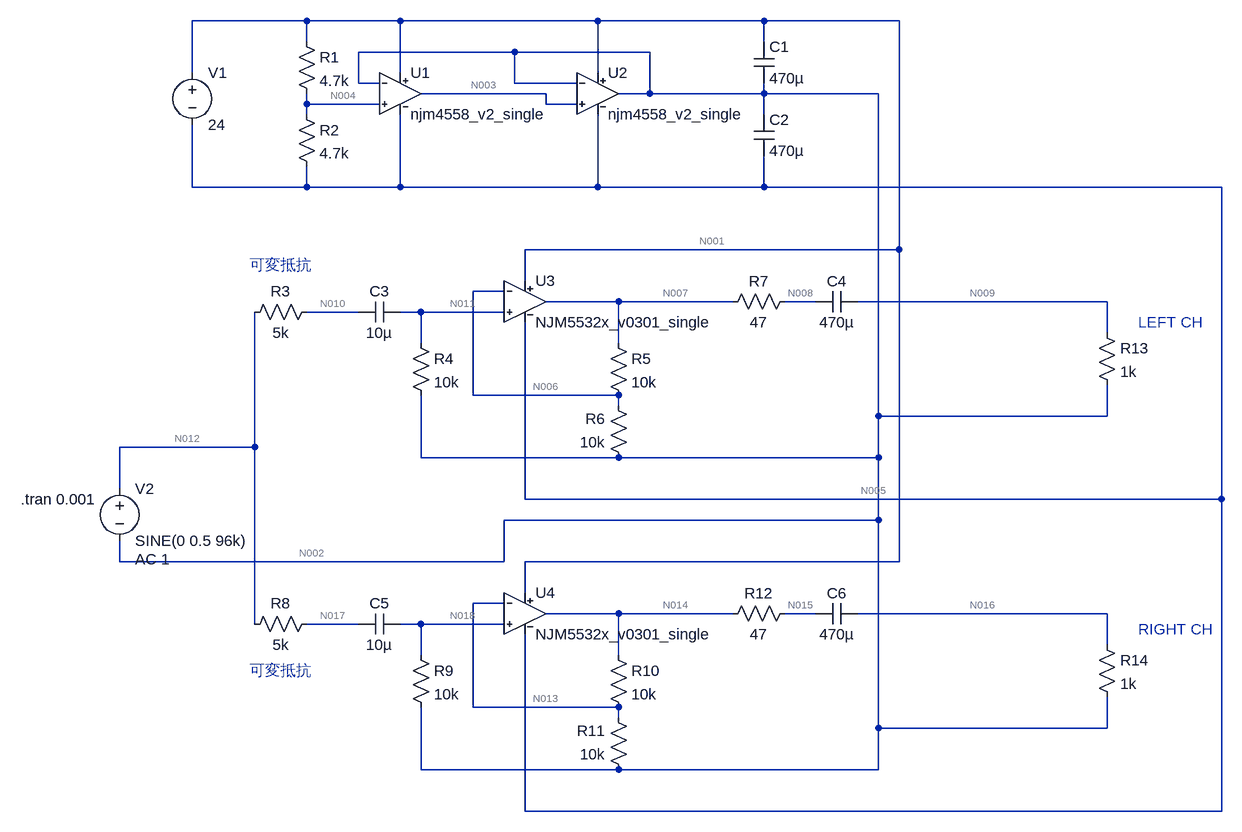
[diagram p0: schematic circuit.asc]
circuit.asc, the LTspice schematic file:
Version 4.1
SHEET 1 1748 1760
WIRE -64 48 -240 48
WIRE 80 48 -64 48
WIRE 384 48 80 48
WIRE 640 48 384 48
WIRE 848 48 640 48
WIRE -64 80 -64 48
WIRE 640 80 640 48
WIRE 256 96 16 96
WIRE 464 96 256 96
WIRE -240 128 -240 48
WIRE 80 128 80 48
WIRE 384 128 384 48
WIRE 16 144 16 96
WIRE 48 144 16 144
WIRE 256 144 256 96
WIRE 352 144 256 144
WIRE 304 160 112 160
WIRE 464 160 464 96
WIRE 464 160 416 160
WIRE 640 160 640 144
WIRE 640 160 464 160
WIRE 816 160 640 160
WIRE -64 176 -64 160
WIRE 48 176 -64 176
WIRE 304 176 304 160
WIRE 352 176 304 176
WIRE -64 192 -64 176
WIRE 640 192 640 160
WIRE -240 304 -240 208
WIRE -64 304 -64 272
WIRE -64 304 -240 304
WIRE 80 304 80 192
WIRE 80 304 -64 304
WIRE 384 304 384 192
WIRE 384 304 80 304
WIRE 640 304 640 256
WIRE 640 304 384 304
WIRE 1344 304 640 304
WIRE 848 400 848 48
WIRE 848 400 272 400
WIRE 272 448 272 400
WIRE 240 464 192 464
WIRE 416 480 304 480
WIRE 592 480 416 480
WIRE 720 480 672 480
WIRE 1168 480 784 480
WIRE 16 496 -64 496
WIRE 112 496 80 496
WIRE 240 496 112 496
WIRE 1168 528 1168 480
WIRE 112 544 112 496
WIRE 416 544 416 480
WIRE 192 624 192 464
WIRE 416 624 192 624
WIRE 416 640 416 624
WIRE 816 656 816 160
WIRE 1168 656 1168 608
WIRE 1168 656 816 656
WIRE -144 704 -144 496
WIRE -144 704 -352 704
WIRE 112 720 112 624
WIRE 416 720 112 720
WIRE 816 720 816 656
WIRE 816 720 416 720
WIRE -352 768 -352 704
WIRE 272 784 272 512
WIRE 1344 784 1344 304
WIRE 1344 784 272 784
WIRE 816 816 816 720
WIRE 816 816 240 816
WIRE -352 880 -352 848
WIRE 240 880 240 816
WIRE 240 880 -352 880
WIRE 848 880 848 400
WIRE 848 880 272 880
WIRE 272 928 272 880
WIRE 240 944 192 944
WIRE 416 960 304 960
WIRE 592 960 416 960
WIRE 720 960 672 960
WIRE 1168 960 784 960
WIRE -144 976 -144 704
WIRE 16 976 -64 976
WIRE 112 976 80 976
WIRE 240 976 112 976
WIRE 1168 1008 1168 960
WIRE 112 1024 112 976
WIRE 416 1024 416 960
WIRE 192 1104 192 944
WIRE 416 1104 192 1104
WIRE 416 1120 416 1104
WIRE 816 1136 816 816
WIRE 1168 1136 1168 1088
WIRE 1168 1136 816 1136
WIRE 112 1200 112 1104
WIRE 416 1200 112 1200
WIRE 816 1200 816 1136
WIRE 816 1200 416 1200
WIRE 272 1264 272 992
WIRE 1344 1264 1344 784
WIRE 1344 1264 272 1264
SYMBOL NJM4558 80 96 R0
SYMATTR InstName U1
SYMBOL NJM4558 384 96 R0
SYMATTR InstName U2
SYMBOL voltage -240 112 R0
WINDOW 123 0 0 Left 0
WINDOW 39 0 0 Left 0
SYMATTR InstName V1
SYMATTR Value 24
SYMBOL res -80 64 R0
SYMATTR InstName R1
SYMATTR Value 4.7k
SYMATTR SpiceLine tol=1
SYMBOL res -80 176 R0
SYMATTR InstName R2
SYMATTR Value 4.7k
SYMATTR SpiceLine tol=1
SYMBOL cap 624 80 R0
SYMATTR InstName C1
SYMATTR Value 470µ
SYMBOL cap 624 192 R0
SYMATTR InstName C2
SYMATTR Value 470µ
SYMBOL res -48 480 R90
WINDOW 0 0 56 VBottom 2
WINDOW 3 32 56 VTop 2
SYMATTR InstName R3
SYMATTR Value 5k
SYMATTR SpiceLine tol=1
SYMBOL res 96 528 R0
SYMATTR InstName R4
SYMATTR Value 10k
SYMATTR SpiceLine tol=1
SYMBOL res 400 528 R0
SYMATTR InstName R5
SYMATTR Value 10k
SYMATTR SpiceLine tol=1
SYMBOL res 432 736 R180
WINDOW 0 36 76 Left 2
WINDOW 3 36 40 Left 2
SYMATTR InstName R6
SYMATTR Value 10k
SYMATTR SpiceLine tol=1
SYMBOL res 688 464 R90
WINDOW 0 0 56 VBottom 2
WINDOW 3 32 56 VTop 2
SYMATTR InstName R7
SYMATTR Value 47
SYMATTR SpiceLine tol=1
SYMBOL cap 80 480 R90
WINDOW 0 0 32 VBottom 2
WINDOW 3 32 32 VTop 2
SYMATTR InstName C3
SYMATTR Value 10µ
SYMBOL cap 784 464 R90
WINDOW 0 0 32 VBottom 2
WINDOW 3 32 32 VTop 2
SYMATTR InstName C4
SYMATTR Value 470µ
SYMBOL NJM5532 272 416 R0
SYMATTR InstName U3
SYMBOL voltage -352 752 R0
WINDOW 123 24 124 Left 2
WINDOW 39 0 0 Left 0
SYMATTR Value2 AC 1
SYMATTR InstName V2
SYMATTR Value SINE(0 0.5 96k)
SYMBOL res 1152 512 R0
SYMATTR InstName R13
SYMATTR Value 1k
SYMBOL res -48 960 R90
WINDOW 0 0 56 VBottom 2
WINDOW 3 32 56 VTop 2
SYMATTR InstName R8
SYMATTR Value 5k
SYMATTR SpiceLine tol=1
SYMBOL res 96 1008 R0
SYMATTR InstName R9
SYMATTR Value 10k
SYMATTR SpiceLine tol=1
SYMBOL res 400 1008 R0
SYMATTR InstName R10
SYMATTR Value 10k
SYMATTR SpiceLine tol=1
SYMBOL res 432 1216 R180
WINDOW 0 36 76 Left 2
WINDOW 3 36 40 Left 2
SYMATTR InstName R11
SYMATTR Value 10k
SYMATTR SpiceLine tol=1
SYMBOL res 688 944 R90
WINDOW 0 0 56 VBottom 2
WINDOW 3 32 56 VTop 2
SYMATTR InstName R12
SYMATTR Value 47
SYMATTR SpiceLine tol=1
SYMBOL cap 80 960 R90
WINDOW 0 0 32 VBottom 2
WINDOW 3 32 32 VTop 2
SYMATTR InstName C5
SYMATTR Value 10µ
SYMBOL cap 784 944 R90
WINDOW 0 0 32 VBottom 2
WINDOW 3 32 32 VTop 2
SYMATTR InstName C6
SYMATTR Value 470µ
SYMBOL NJM5532 272 896 R0
SYMATTR InstName U4
SYMBOL res 1152 992 R0
SYMATTR InstName R14
SYMATTR Value 1k
TEXT -504 784 Left 2 !.tran 0.001
TEXT 1216 512 Left 2 ;LEFT CH
TEXT 1216 984 Left 2 ;RIGHT CH
TEXT -152 424 Left 2 ;可変抵抗
TEXT -152 1048 Left 2 ;可変抵抗

The netlist it stands for:
* circuit.asc
X§U1 N004 N002 N001 N005 N003 njm4558_v2_single  ; pins In+ In- V+ V- OUT
X§U2 N003 N002 N001 N005 N002 njm4558_v2_single  ; pins In+ In- V+ V- OUT
V1 N001 N005 24
R1 N001 N004 4.7k tol=1
R2 N004 N005 4.7k tol=1
C1 N001 N002 470µ
C2 N002 N005 470µ
R3 N010 N012 5k tol=1
R4 N011 N002 10k tol=1
R5 N007 N006 10k tol=1
R6 N002 N006 10k tol=1
R7 N008 N007 47 tol=1
C3 N011 N010 10µ
C4 N009 N008 470µ
X§U3 N011 N006 N001 N005 N007 NJM5532x_v0301_single  ; pins In+ In- V+ V- OUT
V2 N012 N002 SINE(0 0.5 96k) AC 1
R13 N009 N002 1k
R8 N017 N012 5k tol=1
R9 N018 N002 10k tol=1
R10 N014 N013 10k tol=1
R11 N002 N013 10k tol=1
R12 N015 N014 47 tol=1
C5 N018 N017 10µ
C6 N016 N015 470µ
X§U4 N018 N013 N001 N005 N014 NJM5532x_v0301_single  ; pins In+ In- V+ V- OUT
R14 N016 N002 1k
.tran 0.001
* LEFT CH
* RIGHT CH
* 可変抵抗
* 可変抵抗
.lib njm4558_v2_single.lib
.lib NJM5532x_v0301_single.lib
.backanno
.end

* Results of the author's LTspice run, read from the files saved beside the schematic
* Operating Point, zero values left out:
*   V(n001) = 12.2 V
*   V(n002) = 198.2 mV
*   V(n003) = 198.7 mV
*   V(n004) = 198.7 mV
*   V(n005) = -11.8 V
*   V(n006) = 195.7 mV
*   V(n007) = 195.2 mV
*   V(n008) = 195.2 mV
*   V(n009) = 198.2 mV
*   V(n010) = 198.2 mV
*   V(n011) = 196.2 mV
*   V(n012) = 198.2 mV
*   V(n013) = 195.7 mV
*   V(n014) = 195.2 mV
*   V(n015) = 195.2 mV
*   V(n016) = 198.2 mV
*   V(n017) = 198.2 mV
*   V(n018) = 196.2 mV
*   I(R1) = 2.553 mA
*   I(R10) = -43.43 nA
*   I(R11) = 247.7 nA
*   I(R2) = 2.553 mA
*   I(R4) = -197 nA
*   I(R5) = -43.43 nA
*   I(R6) = 247.7 nA
*   I(R9) = -197 nA
*   I(V1) = -15.13 mA
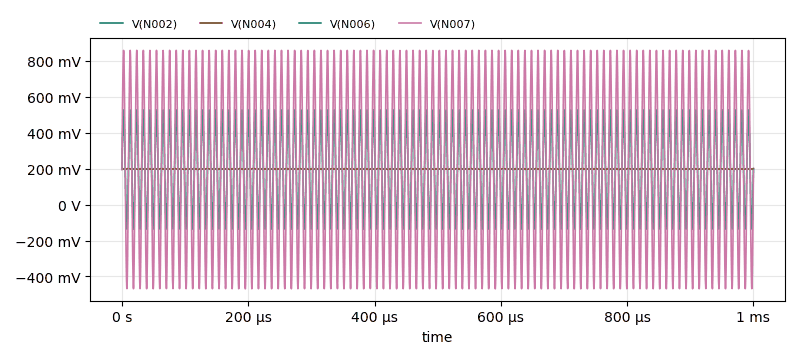
[diagram p1: Transient Analysis of circuit.asc, plotted from the saved traces]
* Transient Analysis, 1 run:
*   V(N002): min 196 mV, max 200.7 mV, average 198.1 mV, rms 198.1 mV, last 200.1 mV
*   V(N004): min 196.6 mV, max 201.1 mV, average 198.6 mV, rms 198.6 mV, last 200.6 mV
*   V(N006): min -136.4 mV, max 527.5 mV, average 194.5 mV, rms 302.6 mV, last 194.4 mV
*   V(N007): min -468.8 mV, max 858.8 mV, average 192.9 mV, rms 502.2 mV, last 190.6 mV